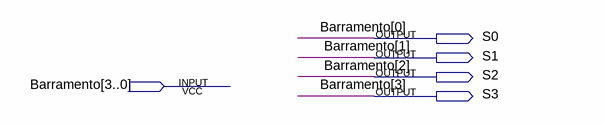
[diagram p0: schematic sheet]
// Quartus schematic tap.bdf as structural Verilog: 0 symbols, 5 pins
module tap (
  input  [3:0] Barramento,
  output S0,
  output S1,
  output S2,
  output S3
);


  assign S0 = Barramento[0];
  assign S1 = Barramento[1];
  assign S2 = Barramento[2];
  assign S3 = Barramento[3];
endmodule
